# Altium schematic sheet Sheet_1.schdoc
size 114 x 93 mm
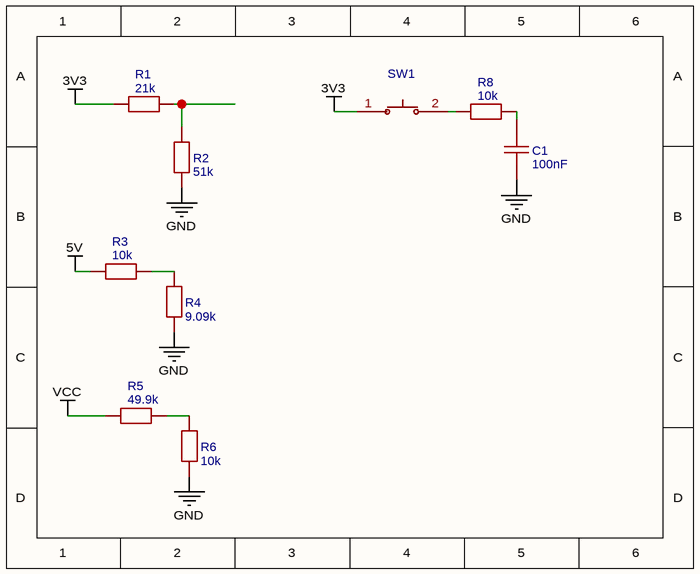
[diagram p0: Sheet_1.schdoc]

## Parts
C1  100nF  [C0603]
R1  21k  [R0603]
R2  51k  [R0805]
R3  10k  [R0805]
R4  9.09k  [R0603]
R5  49.9k  [R0805]
R6  10k  [R0805]
R8  10k  [R0603]
SW1  TS3625A  [KEY-SMD_L6.0-W3.5-LS8.4]  (value not drawn)

## Nets
3V3: R1.1 SW1.1
5V: R3.1
GND: C1.1 R2.1 R4.1 R6.1
VCC: R5.1
NetC1_2: C1.2 R8.2
NetR1_2: R1.2 R2.2
NetR3_2: R3.2 R4.2
NetR5_2: R5.2 R6.2
NetR8_1: R8.1 SW1.2

## Library data of the parts
C1 = 100nF: nameAlias: Value(F); Contributor: LCEDA_Lib; spicePre: C; spiceSymbolName: C_0603_US
R1 = 21k: nameAlias: Value(Ω); Contributor: LCEDA_Lib; spicePre: R; spiceSymbolName: R_0603_EU
R2 = 51k: nameAlias: Value(Ω); Contributor: LCEDA_Lib; spicePre: R; spiceSymbolName: R_0805_EU
R3 R6 R8 = 10k: nameAlias: Value(Ω); Contributor: LCEDA_Lib; spicePre: R
  R3 R6: spiceSymbolName: R_0805_EU
  R8: spiceSymbolName: R_0603_EU
R4 = 9.09k: nameAlias: Value(Ω); Contributor: LCEDA_Lib; spicePre: R; spiceSymbolName: R_0603_EU
R5 = 49.9k: nameAlias: Value(Ω); Contributor: LCEDA_Lib; spicePre: R; spiceSymbolName: R_0805_EU
SW1 = TS3625A: Manufacturer: SHOU HAN(首韩); Contributor: LCSC; Supplier: LCSC; Supplier Part: C398053; Manufacturer Part: TS3625A; JLCPCB Part Class: Extended Part; spicePre: S; spiceSymbolName: TS3625A